# EasyEDA schematic SCH_pipicoshield_2023-05-22.json
TITLE: Sheet_1; REV: 1.0; Date: 2023-05-17; Sheet: 1/1; Drawn By: bevanfairleigh; Company: Your Company
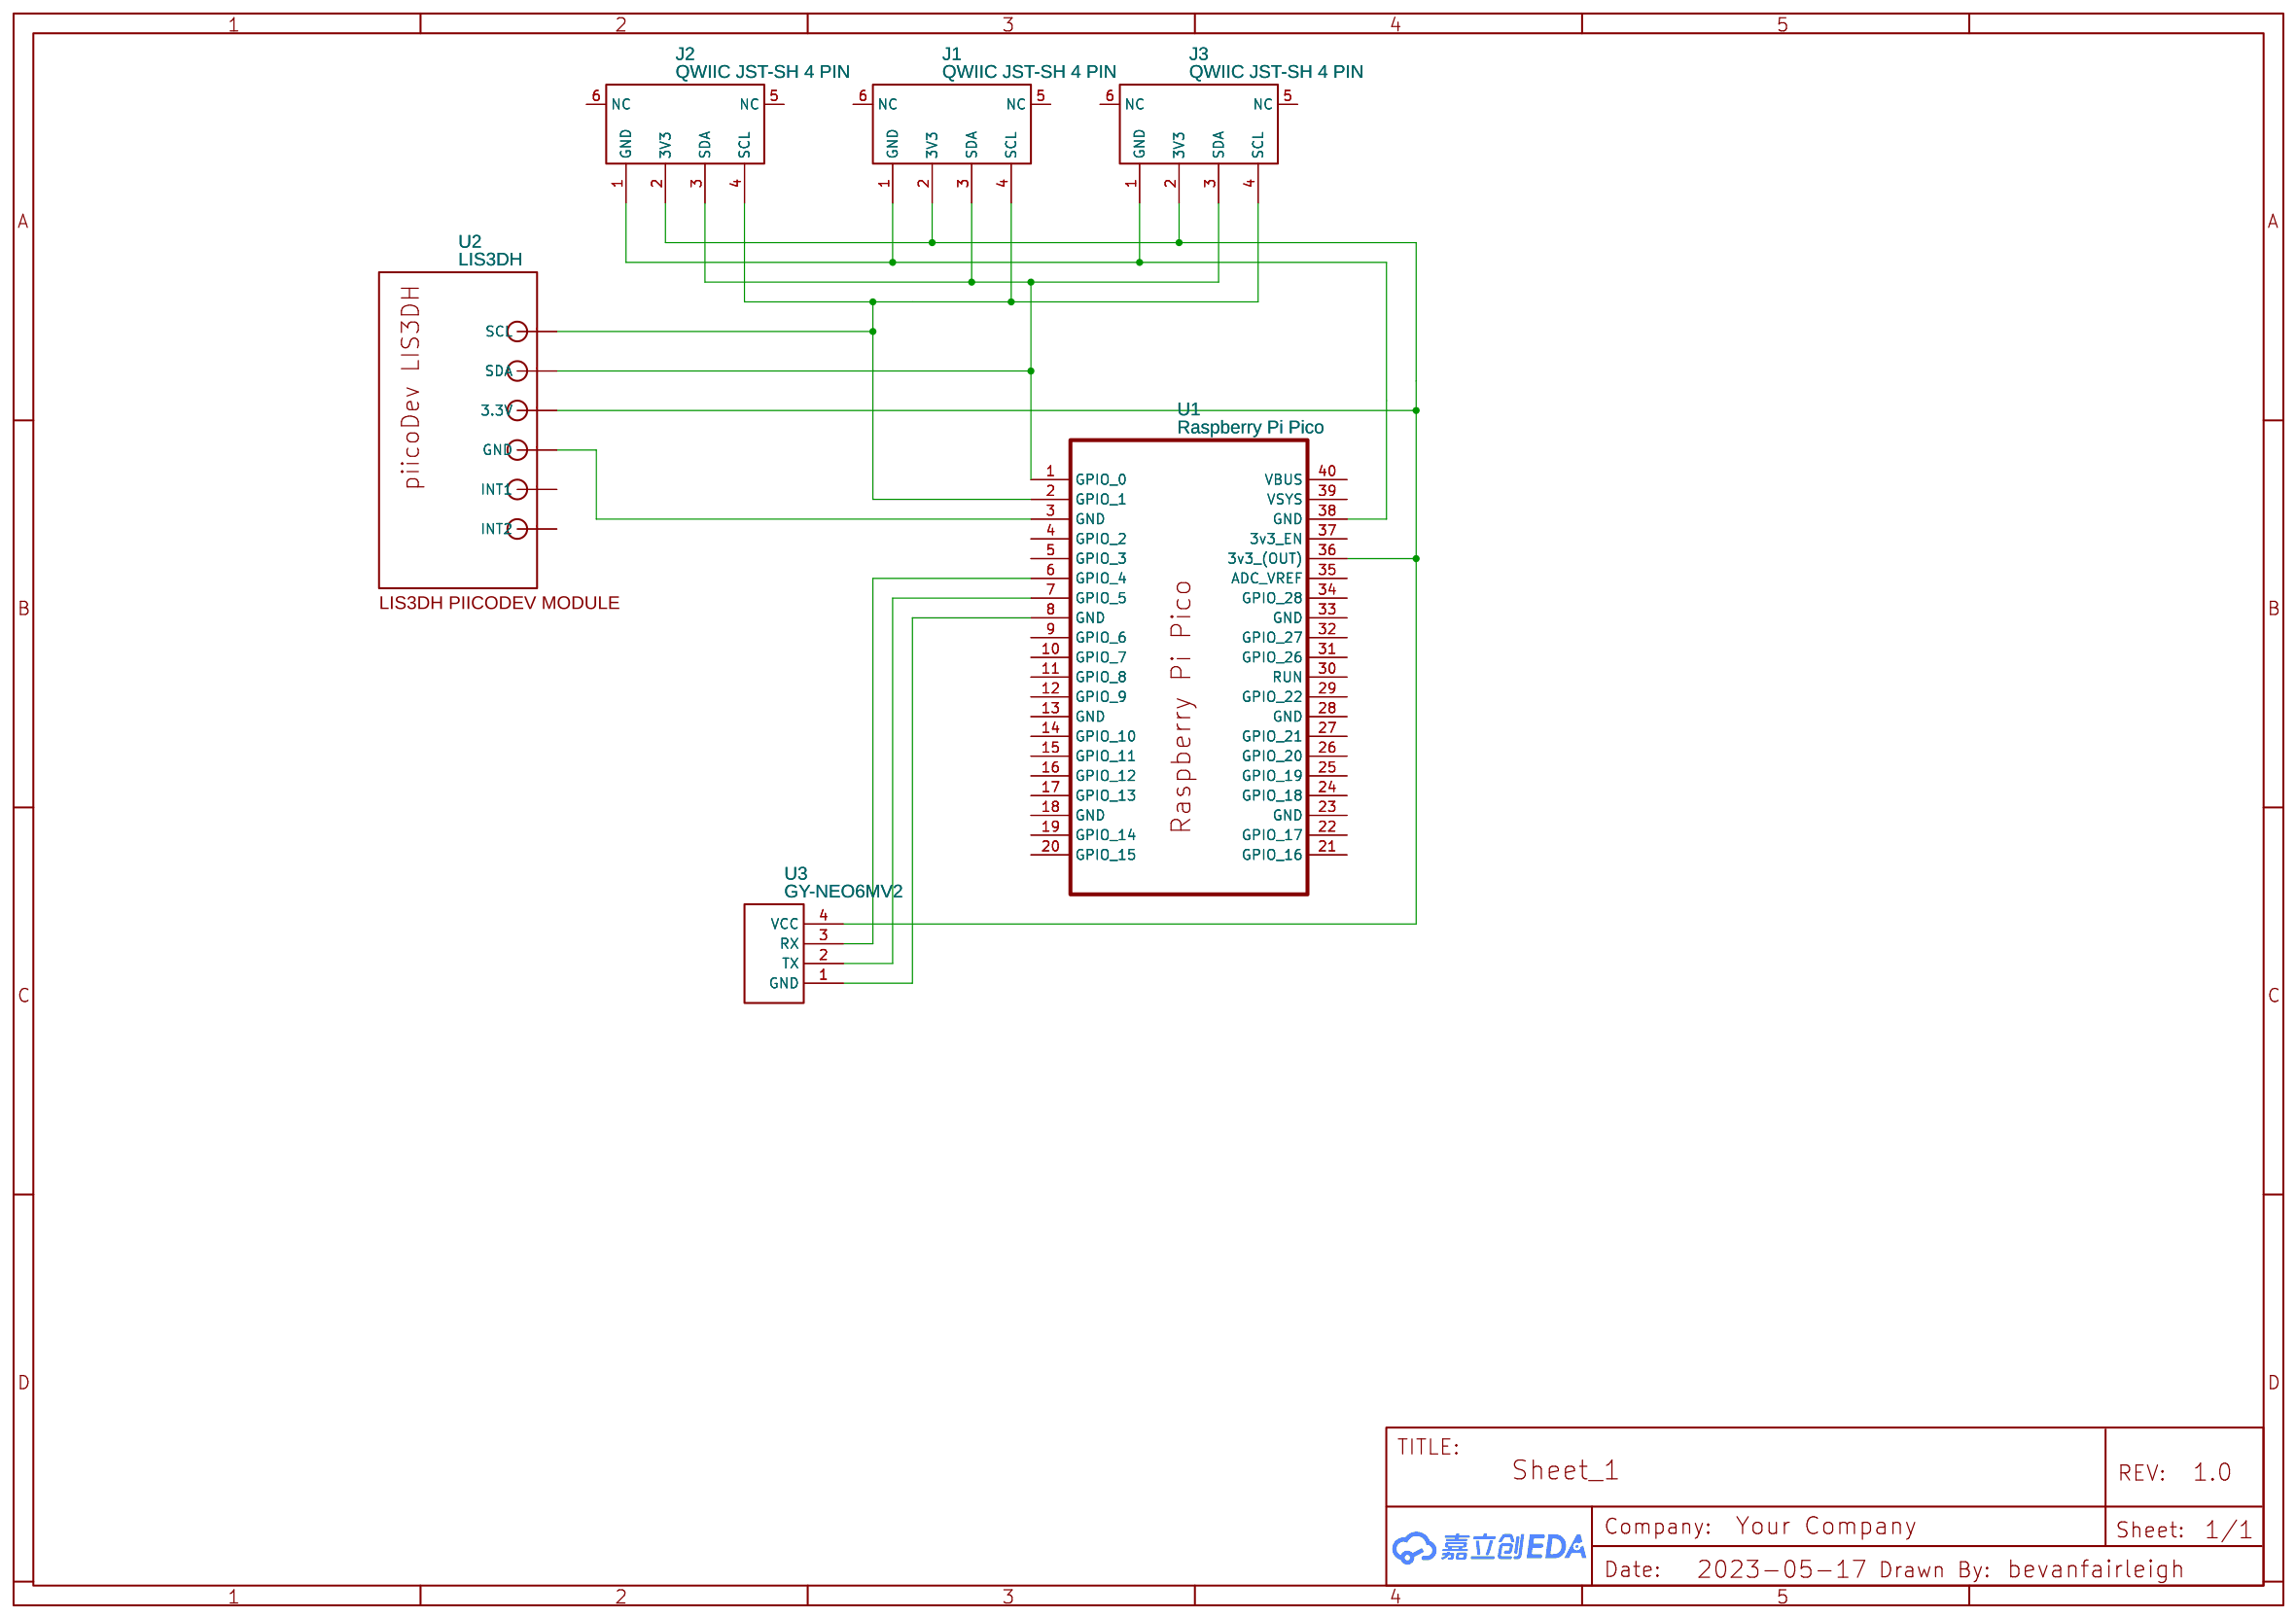
[diagram p0: schematic sheet]

## Parts
J1  QWIIC JST-SH 4 PIN  [QWIIC JST-SH 4 PIN]
J2  QWIIC JST-SH 4 PIN  [QWIIC JST-SH 4 PIN]
J3  QWIIC JST-SH 4 PIN  [QWIIC JST-SH 4 PIN]
U1  Raspberry Pi Pico  [RASPBERRY PI PICO/ RASPBERRY PI PICO W]
U2  LIS3DH  [LIS3DH PIICODEV MODULE]
U3  GY-NEO6MV2  [GY-NEO6MV2]

## Library data of the parts
J1-J3 = QWIIC JST-SH 4 PIN: Contributor: eriochrome
U1 = Raspberry Pi Pico W: Contributor: sunilgoud410
U2 = BME280: Manufacturer: piicodev; Contributor: jmcconochie; Package Display: Yes
U3 = GY-NEO6MV2: Contributor: Michaël Pégeot

## Nets
Net-(J1-1): J1.1(GND) J2.1(GND) J3.1(GND) U1.38(GND)
Net-(J1-2): J1.2(3V3) J2.2(3V3) J3.2(3V3) U1.36(3v3 (OUT)) U2.4(3.3V) U3.4(VCC)
Net-(J1-3): J1.3(SDA) J2.3(SDA) J3.3(SDA) U1.1(GPIO 0) U2.5(SDA)
Net-(J1-4): J1.4(SCL) J2.4(SCL) J3.4(SCL) U1.2(GPIO 1) U2.6(SCL)
Net-(U1-3): U1.3(GND) U2.3(GND)
Net-(U1-6): U1.6(GPIO 4) U3.3(RX)
Net-(U1-7): U1.7(GPIO 5) U3.2(TX)
Net-(U1-8): U1.8(GND) U3.1(GND)

Not connected (* = marked no-connect by the designer): J1 5(NC) 6(NC); J2 5(NC) 6(NC); J3 5(NC) 6(NC); U1 4(GPIO 2) 5(GPIO 3) 9(GPIO 6) 10(GPIO 7) 11(GPIO 8) 12(GPIO 9) 13(GND) 14(GPIO 10) 15(GPIO 11) 16(GPIO 12) 17(GPIO 13) 18(GND) 19(GPIO 14) 20(GPIO 15) 21(GPIO 16) 22(GPIO 17) 23(GND) 24(GPIO 18) 25(GPIO 19) 26(GPIO 20) 27(GPIO 21) 28(GND) 29(GPIO 22) 30(RUN) 31(GPIO 26) 32(GPIO 27) 33(GND) 34(GPIO 28) 35(ADC_VREF) 37(3v3_EN) 39(VSYS) 40(VBUS); U2 1(INT2) 2(INT1)
